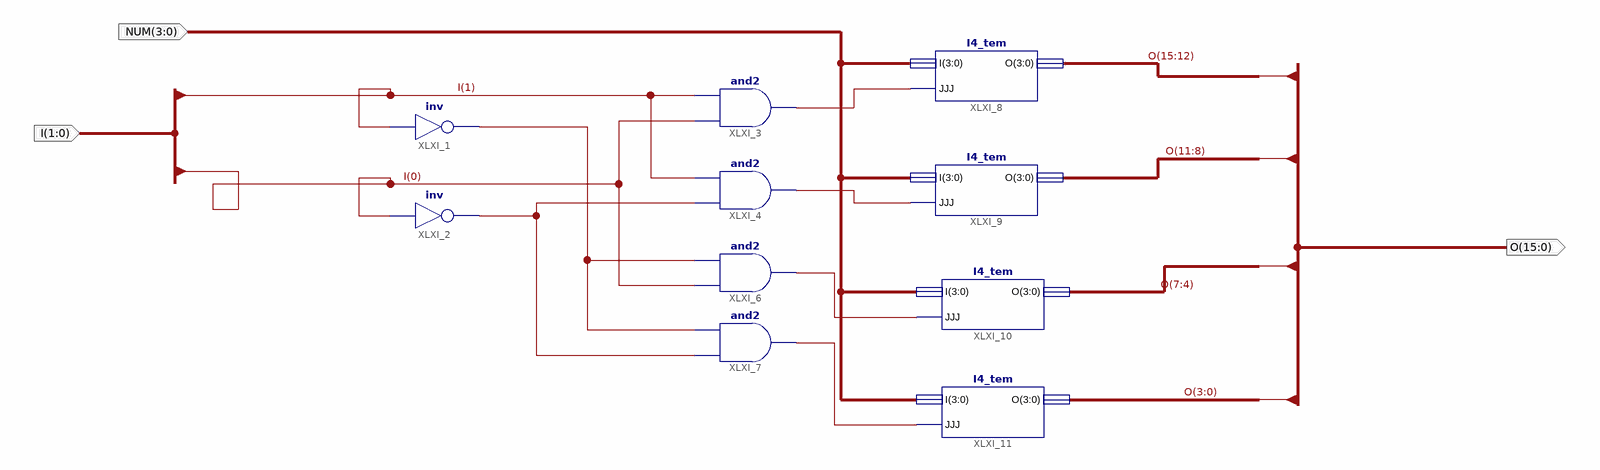
[diagram p0: schematic sheet 1]
// Xilinx ISE schematic DMUX2_4.sch (spartan3) as structural Verilog: 10 symbols, 3 ports
module DMUX2_4 (
  input  [1:0] I,
  input  [3:0] NUM,
  output [15:0] O
);

  wire XLXN_13, XLXN_18, XLXN_19, XLXN_20, XLXN_21, XLXN_28;

  not XLXI_1 (XLXN_28, I[1]);
  not XLXI_2 (XLXN_13, I[0]);
  and XLXI_3 (XLXN_18, I[0], I[1]);
  and XLXI_4 (XLXN_19, XLXN_13, I[1]);
  and XLXI_6 (XLXN_20, I[0], XLXN_28);
  and XLXI_7 (XLXN_21, XLXN_13, XLXN_28);
  I4_tem XLXI_8 (.I(NUM), .JJJ(XLXN_18), .O(O[15:12]));
  I4_tem XLXI_9 (.I(NUM), .JJJ(XLXN_19), .O(O[11:8]));
  I4_tem XLXI_10 (.I(NUM), .JJJ(XLXN_20), .O(O[7:4]));
  I4_tem XLXI_11 (.I(NUM), .JJJ(XLXN_21), .O(O[3:0]));
endmodule
